# EAGLE design receiver (EAGLE 9.6.2)
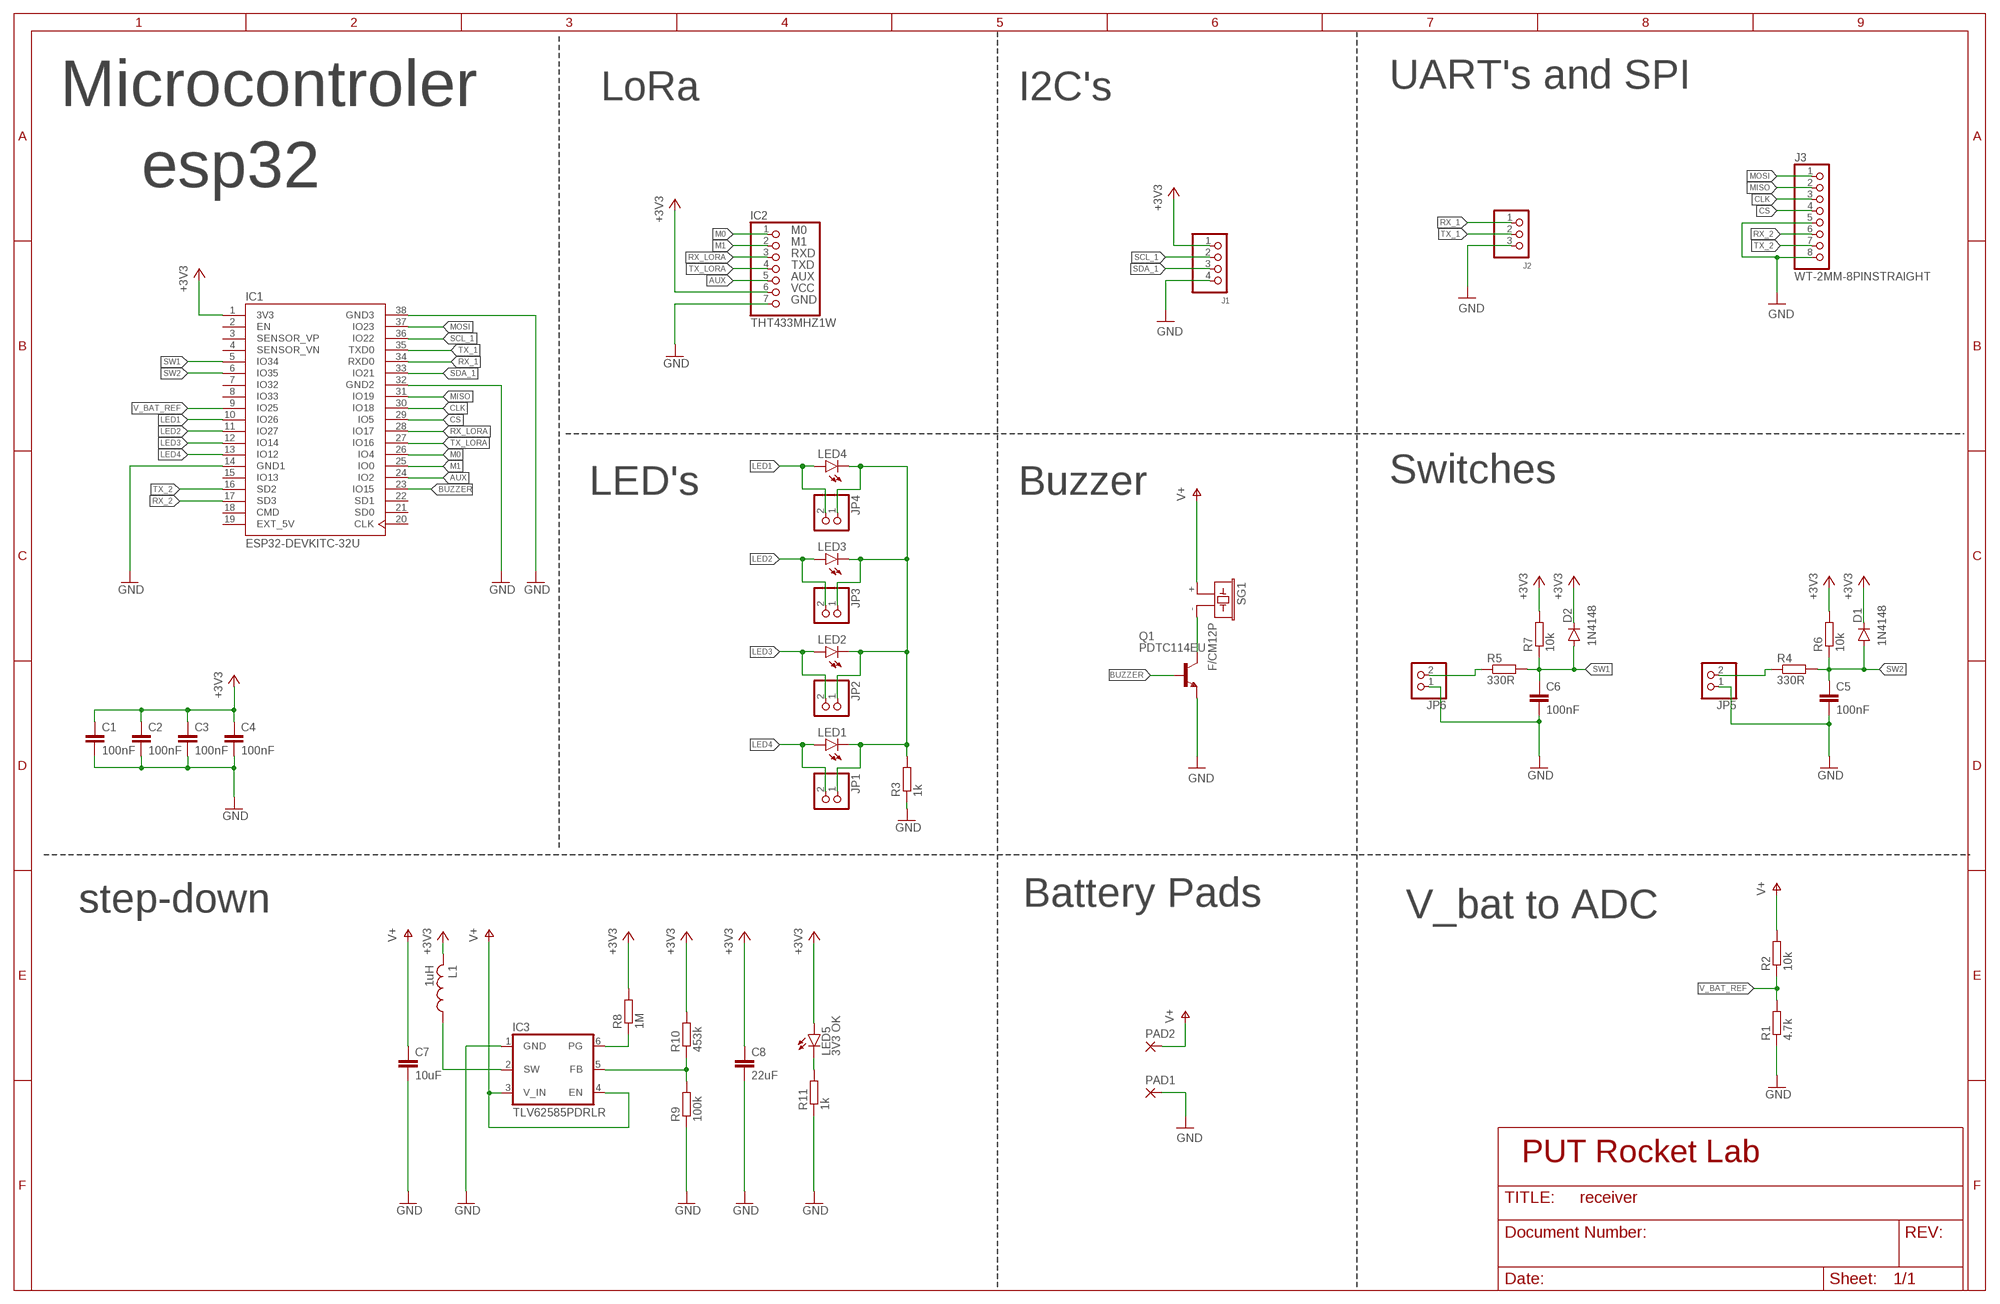
[diagram p0: schematic, sheet 1]

## Parts
C1  100nF  C-EUC0805  [C0805]
C2  100nF  C-EUC0805  [C0805]
C3  100nF  C-EUC0805  [C0805]
C4  100nF  C-EUC0805  [C0805]
C5  100nF  C-EUC0805  [C0805]
C6  100nF  C-EUC0805  [C0805]
C7  10uF  C-EUC0805  [C0805]
C8  22uF  C-EUC0805  [C0805]
D1  1N4148  DIODE-SOD80C  [SOD80C]
D2  1N4148  DIODE-SOD80C  [SOD80C]
IC1  ESP32-DEVKITC-32U  [MODULE_ESP32-DEVKITC-32U]
IC2  THT433MHZ1W  [E32M1000]
IC3  TLV62585PDRLR  [SOT563]
J1  WT-2MM-4PINSTRAIGHT  [W_TYPE_2MM_4_N]
J2  WT-2MM-3PINSTRAIGHT  [W_TYPE_2MM_3_N]
J3  WT-2MM-8PINSTRAIGHT  [W_TYPE_2MM_8_N]
JP1  PINHD-1X2  [1X02]
JP2  PINHD-1X2  [1X02]
JP3  PINHD-1X2  [1X02]
JP4  PINHD-1X2  [1X02]
JP5  PINHD-1X2  [1X02]
JP6  PINHD-1X2  [1X02]
L1  1uH  L-USL5650M  [L5650M]
LED1  LEDCHIPLED_0805  [CHIPLED_0805]
LED2  LEDCHIPLED_0805  [CHIPLED_0805]
LED3  LEDCHIPLED_0805  [CHIPLED_0805]
LED4  LEDCHIPLED_0805  [CHIPLED_0805]
LED5  3V3 OK  LEDCHIPLED_0805  [CHIPLED_0805]
PAD1  WIREPAD2,54/1,1  [2,54/1,1]
PAD2  WIREPAD2,54/1,1  [2,54/1,1]
Q1  PDTC114EU  BC846ASMD  [SOT23]
R1  4.7k  R-EU_R0805  [R0805]
R2  10k  R-EU_R0805  [R0805]
R3  1k  R-EU_R0805  [R0805]
R4  330R  R-EU_R0805  [R0805]
R5  330R  R-EU_R0805  [R0805]
R6  10k  R-EU_R0805  [R0805]
R7  10k  R-EU_R0805  [R0805]
R8  1M  R-EU_R0805  [R0805]
R9  100k  R-EU_R0805  [R0805]
R10  453k  R-EU_R0805  [R0805]
R11  1k  R-EU_R0805  [R0805]
SG1  F/CM12P  [F/CM12P]

## Nets
+3V3: C1.1 C2.1 C3.1 C4.1 C8.1 D1.C D2.C IC1.1(3V3) IC2.6(VCC) J1.1 L1.2 LED5.A R6.2 R7.2 R8.2 R10.2
AUX: IC1.24(IO2) IC2.5(AUX)
BUZZER: IC1.23(IO15) Q1.1(B)
CLK: IC1.30(IO18) J3.3
CS: IC1.29(IO5) J3.4
GND: C1.2 C2.2 C3.2 C4.2 C5.2 C6.2 C7.2 C8.2 IC1.14(GND1) IC1.32(GND2) IC1.38(GND3) IC2.7(GND) IC3.1(GND) J1.4 J2.3 J3.5 J3.8 JP5.1 JP6.1 PAD1.1(P) Q1.2(E) R1.1 R3.1 R9.1 R11.1
LED1: IC1.10(IO26) JP4.2 LED4.A
LED2: IC1.11(IO27) JP3.2 LED3.A
LED3: IC1.12(IO14) JP2.2 LED2.A
LED4: IC1.13(IO12) JP1.2 LED1.A
M0: IC1.26(IO4) IC2.1(M0)
M1: IC1.25(IO0) IC2.2(M1)
MISO: IC1.31(IO19) J3.2
MOSI: IC1.37(IO23) J3.1
N$1: JP1.1 JP2.1 JP3.1 JP4.1 LED1.C LED2.C LED3.C LED4.C R3.2
N$2: LED5.C R11.2
N$3: IC3.5(FB) R9.2 R10.1
N$4: IC3.6(PG) R8.1
N$5: IC3.2(SW) L1.1
N$6: Q1.3(C) SG1.-
N$7: JP6.2 R5.1
N$8: JP5.2 R4.1
RX_1: IC1.34(RXD0) J2.1
RX_2: IC1.17(SD3) J3.6
RX_LORA: IC1.28(IO17) IC2.3(RXD)
SCL_1: IC1.36(IO22) J1.2
SDA_1: IC1.33(IO21) J1.3
SW1: C6.1 D2.A IC1.5(IO34) R5.2 R7.1
SW2: C5.1 D1.A IC1.6(IO35) R4.2 R6.1
TX_1: IC1.35(TXD0) J2.2
TX_2: IC1.16(SD2) J3.7
TX_LORA: IC1.27(IO16) IC2.4(TXD)
V+: C7.1 IC3.3(V_IN) IC3.4(EN) PAD2.1(P) R2.2 SG1.+
V_BAT_REF: IC1.9(IO25) R1.2 R2.1
Unconnected: IC1.2(EN) IC1.3(SENSOR_VP) IC1.4(SENSOR_VN) IC1.7(IO32) IC1.8(IO33) IC1.15(IO13) IC1.18(CMD) IC1.20(CLK) IC1.21(SD0) IC1.22(SD1)

## Notes on the sheet
- LoRa | I2C's | UART's and SPI
- Microcontroler
- esp32
- LED's | Buzzer | Switches
- step-down | Battery Pads | V_bat to ADC
- PUT Rocket Lab

## Power pins joined to a net without a drawn wire
EXT_5V: IC1.19(EXT_5V)

## Library data of the parts
C1-C4 C7 C8 = PUTRocketLab_RCL:C-EU: CAPACITOR, European symbol; SPICEPREFIX: C
C5 C6 = rcl:C-EU: CAPACITOR, European symbol; SPICEPREFIX: C
D1 D2 = diode:DIODE-: DIODE
IC1 = PUTRocketLab_modules:ESP32-DEVKITC-32U: ESP32-DEVKITC Check prices <https://pricing.snapeda.com/search/part/ESP32-DEVKITC-32U/?ref=eda>; AVAILABILITY: Warning; DESCRIPTION: - Transceiver; 802.11 b/g/n (Wi-Fi, WiFi, WLAN), Bluetooth® Smart Ready 4.x Dual Mode For Use With ESP32-WROOM-32UE; MF: Espressif Systems; MP: ESP32-DEVKITC-32U; PACKAGE: None; PRICE: None; PURCHASE-URL: https://pricing.snapeda.com/search/part/ESP32-DEVKITC-32U/?ref=eda
IC2 = PUTRocketLab_modules:THT433MHZ1W
IC3 = PUTRocketLab_IC:TLV62585PDRLR
J1 = PUTRocketLab_connectors:WT-2MM-4PIN
J2 = PUTRocketLab_connectors:WT-2MM-3PIN
J3 = PUTRocketLab_connectors:WT-2MM-8PIN
JP1-JP6 = PUTRocketLab_connectors:PINHD-1X2: PIN HEADER
L1 = rcl:L-US: INDUCTOR, American symbol; SPICEPREFIX: L
LED1-LED5 = PUTRocketLab_semiconductors:LED: LED OSRAM: - CHIPLED LG R971, LG N971, LY N971, LG Q971, LY Q971, LO R971, LY R971 LH N974, LH R974 LS Q976, LO Q976, LY Q976 LO Q996 - Hyper CHIPLED LW Q18S LB Q993, LB Q99A, LB R99A - SideLED LS A670, LO A670, LY A670, LG A670, LP A670 LB A673, LV A673, LT A673, LW A673 LH A674 LY A675 LS A676, LA A676, LO A676, LY A676, LW A676 LS A679, LY A679, LG A679 - Hyper Micro SIDELED® LS Y876, LA Y876, LO Y876, LY Y876 LT Y87S - SmartLED LW L88C, LW L88S LB L89C, LB L89S, LG L890 LS L89K, LO L89K, LY L89K LS L896, LA L896, LO L896, LY L896 - TOPLED LS T670, LO T670, LY T670, LG T670, LP T670 LSG T670, LSP T670, LSY T670, LOP T670, LYG T670 LG T671, LOG T671, LSG T671 LB T673, LV T673, LT T673, LW T673 LH T674 LS T676, LA T676, LO T676, LY T676, LB T676, LH T676, LSB T676, LW T676 LB T67C, LV T67C, LT T67C, LS T67K, LO T67K, LY T67K, LW E67C LS E67B, LA E67B, LO E67B, LY E67B, LB E67C, LV E67C, LT E67C LW T67C LS T679, LY T679, LG T679 LS T770, LO T770, LY T770, LG T770, LP T770 LB T773, LV T773, LT T773, LW T773 LH T774 LS E675, LA E675, LY E675, LS T675 LS T776, LA T776, LO T776, LY T776, LB T776 LHGB T686 LT T68C, LB T68C - Hyper Mini TOPLED® LB M676 - Mini TOPLED Santana® LG M470 LS M47K, LO M47K, LY M47K Source: http://www.osram.convergy.de LUXEON: - LUMILED® LXK2-PW12-R00, LXK2-PW12-S00, LXK2-PW14-U00, LXK2-PW14-V00 LXK2-PM12-R00, LXK2-PM12-S00, LXK2-PM14-U00 LXK2-PE12-Q00, LXK2-PE12-R00, LXK2-PE12-S00, LXK2-PE14-T00, LXK2-PE14-U00 LXK2-PB12-K00, LXK2-PB12-L00, LXK2-PB12-M00, LXK2-PB14-N00, LXK2-PB14-P00, LXK2-PB14-Q00 LXK2-PR12-L00, LXK2-PR12-M00, LXK2-PR14-Q00, LXK2-PR14-R00 LXK2-PD12-Q00, LXK2-PD12-R00, LXK2-PD12-S00 LXK2-PH12-R00, LXK2-PH12-S00 LXK2-PL12-P00, LXK2-PL12-Q00, LXK2-PL12-R00 Source: www.luxeon.com KINGBRIGHT: KA-3528ASYC Source: www.kingbright.com
PAD1 PAD2 = PUTRocketLab_misc:WIREPAD: Wire PAD connect wire on PCB
Q1 = PUTRocketLab_semiconductors:BC846*: NPN Transistor
R1-R3 R8-R11 = PUTRocketLab_RCL:R-EU_: RESISTOR, European symbol; SPICEPREFIX: R
R4-R7 = rcl:R-EU_: RESISTOR, European symbol; SPICEPREFIX: R
SG1 = buzzer:F/CM12P: BUZZER Source: Buerklin; OC_FARNELL: unknown; OC_NEWARK: unknown

## Board
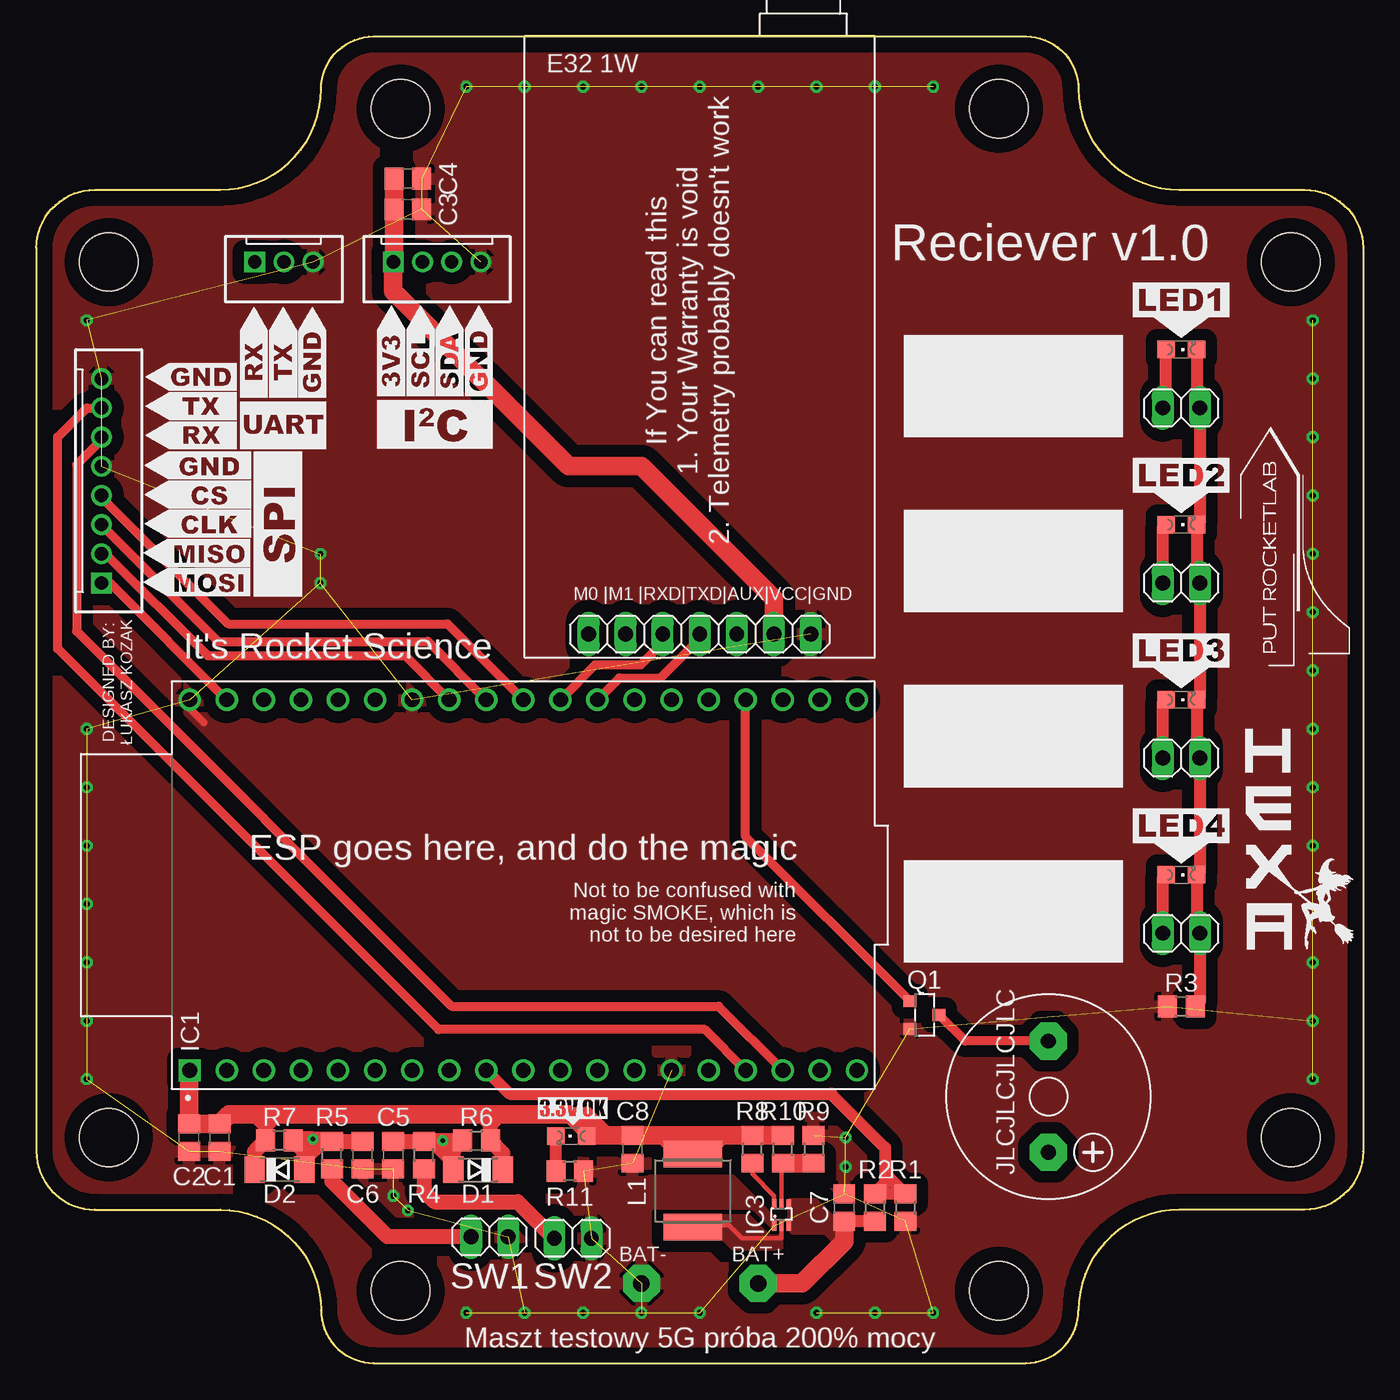
[diagram p1: board, top side]
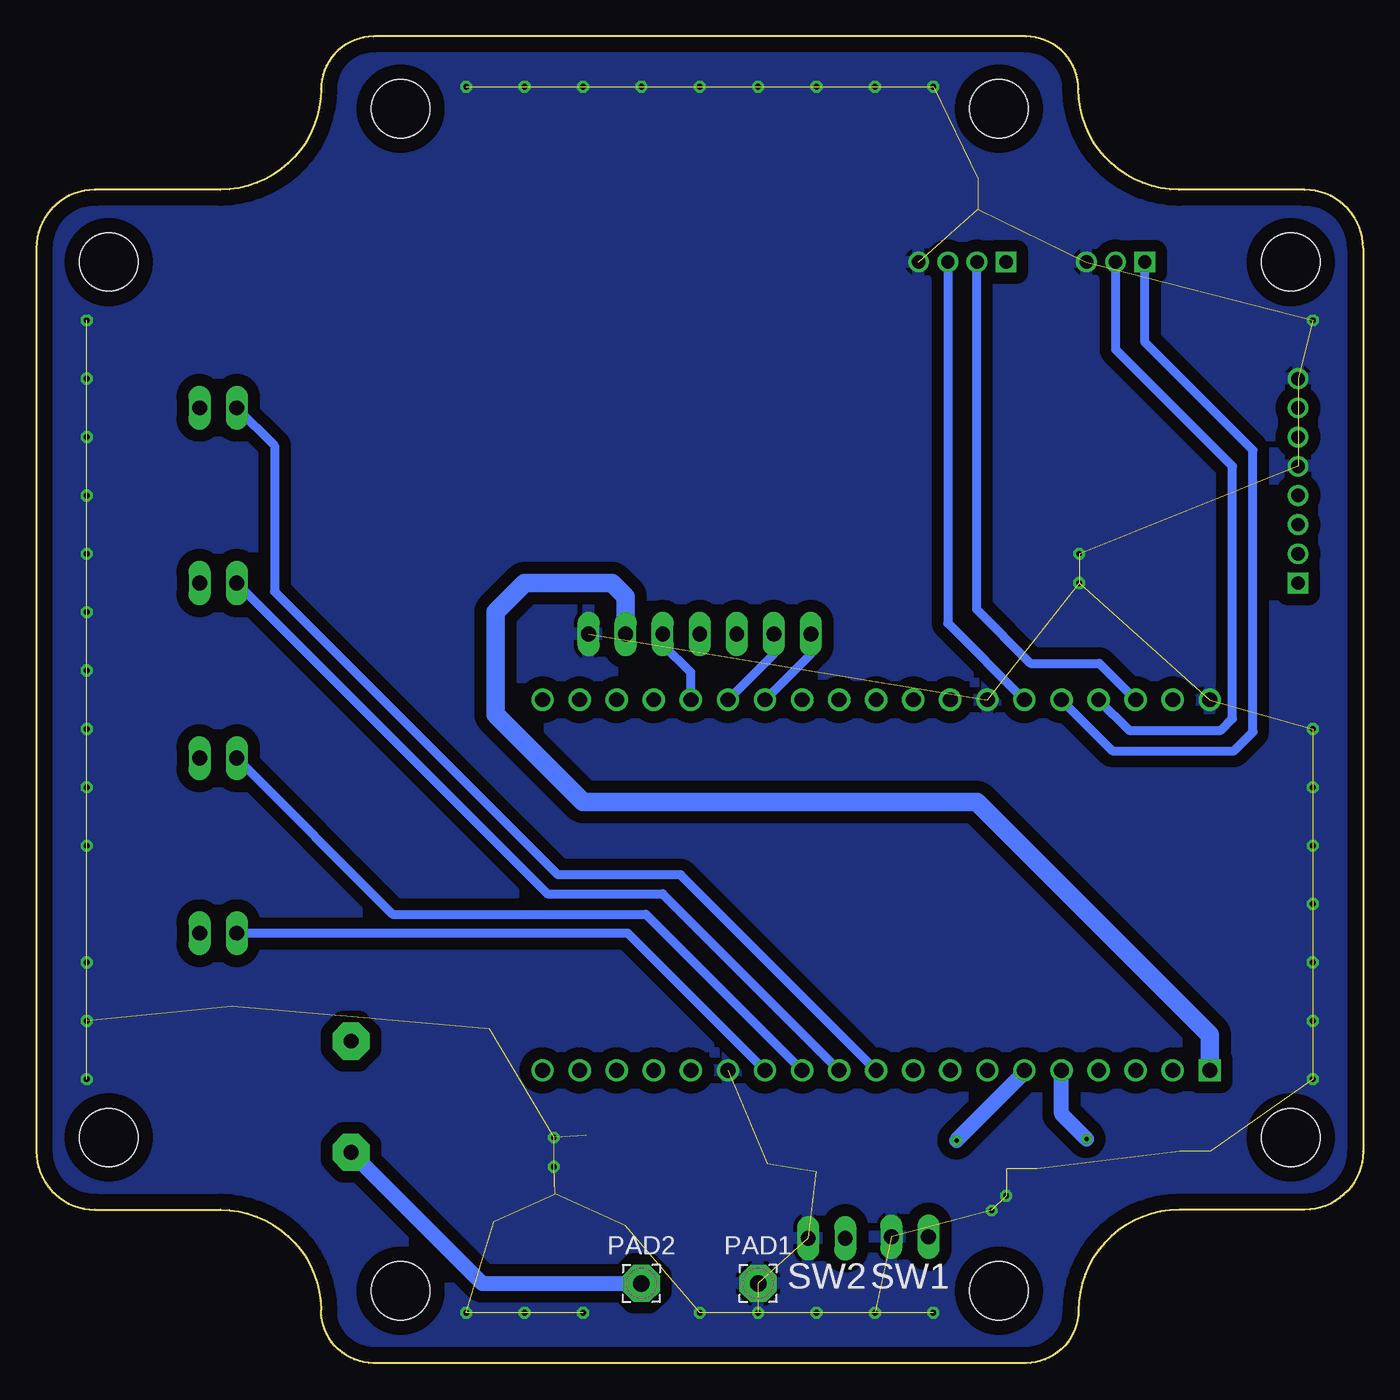
[diagram p2: board, bottom side, seen from below]

Size 90.9 x 90.9 mm. Coordinates in mm from the lower left corner, seen from the top.
Outline: 19.5,87.3 arc-90 23.1,90.9 67.8,90.9 arc-90 71.4,87.3 arc90 78.3,80.4 86.9,80.4 arc-90 90.9,76.4 90.9,14.5 arc-90 86.9,10.5 78.3,10.5 arc90 71.4,3.6 arc-90 67.8,0 23.1,0 arc-90 19.5,3.6 arc90 12.6,10.5 4,10.5 arc-90 0,14.5 0,76.4 arc-90 4,80.4 12.6,80.4 arc90 19.5,87.3
Copper layers (1*16): Top 0.035mm / dielectric 1.5mm / Bottom 0.035mm
Design rules "default *": minimum track width 6mil, minimum drill 0.3mm, track to track 10mil, track to pad 10mil, pad to pad 10mil, via to via 10mil, smd to smd 6mil, copper to edge 40mil, drill to drill 6mil, minimum pad ring 10mil, minimum via ring 8mil, stop-mask expansion 4mil, vias tented up to drill 20mil, thermal gap 10mil
Holes 4 mm at 24.95,85.95 65.95,85.95 85.95,75.45 85.95,15.45 65.95,4.95 24.95,4.95 4.95,15.45 4.95,75.45

### Footprints (pad centres in the part's own frame; a part is rotated, then mirrored left to right if it is on the bottom)
C0805 = smd 1.3 x 1.5: 1 -0.95,0; 2 0.95,0
SOD80C = smd 1.4 x 1.8: A 1.7,0; C -1.7,0
MODULE_ESP32-DEVKITC-32U = drill 1.02 square: 1 -12.7,22.85 | drill 1.02: 2 -12.7,20.31; 3 -12.7,17.77; 4 -12.7,15.23; 5 -12.7,12.69; 6 -12.7,10.15; 7 -12.7,7.61; 8 -12.7,5.07; 9 -12.7,2.53; 10 -12.7,-0.01; 11 -12.7,-2.55; 12 -12.7,-5.09; 13 -12.7,-7.63; 14 -12.7,-10.17; 15 -12.7,-12.71; 16 -12.7,-15.25; 17 -12.7,-17.79; 18 -12.7,-20.33; 19 -12.7,-22.87; 20 12.7,-22.87; 21 12.7,-20.33; 22 12.7,-17.79; 23 12.7,-15.25; 24 12.7,-12.71; 25 12.7,-10.17; 26 12.7,-7.63; 27 12.7,-5.09; 28 12.7,-2.55; 29 12.7,-0.01; 30 12.7,2.53; 31 12.7,5.07; 32 12.7,7.61; 33 12.7,10.15; 34 12.7,12.69; 35 12.7,15.23; 36 12.7,17.77; 37 12.7,20.31; 38 12.7,22.85
E32M1000 = drill 1.016 long: 1 -7.62,0; 2 -5.08,0; 3 -2.54,0; 4 0,0; 5 2.54,0; 6 5.08,0; 7 7.62,0
SOT563 = smd 0.3 x 0.67: 1 -0.5,-0.74; 2 0,-0.74; 3 0.5,-0.74; 4 0.5,0.74; 5 0,0.74; 6 -0.5,0.74
W_TYPE_2MM_4_N = drill 0.914 square: 1 -3,0 | drill 0.914: 2 -1,0; 3 1,0; 4 3,0
W_TYPE_2MM_3_N = drill 0.914 square: 1 -2,0 | drill 0.914: 2 0,0; 3 2,0
W_TYPE_2MM_8_N = drill 0.914 square: 1 -7,0 | drill 0.914: 2 -5,0; 3 -3,0; 4 -1,0; 5 1,0; 6 3,0; 7 5,0; 8 7,0
1X02 = drill 1.016 long: 1 -1.27,0; 2 1.27,0
L5650M = smd 1.8 x 4: 1 -2.5,0; 2 2.5,0
CHIPLED_0805 = smd 1.2 x 1.2: A 0,-1.05; C 0,1.05
2,54/1,1 = drill 1.118 pad 2.54 octagon: 1 0,0
SOT23 = smd 0.8 x 0.9: 1 -0.95,-1; 2 0.95,-1; 3 0,1
R0805 = smd 1.3 x 1.5: 1 -0.95,0; 2 0.95,0
F/CM12P = drill 1.016 pad 2.54 octagon: + 3.81,0; - -3.81,0

### Placement (x,y rotation side)
C1  12.55,15.45 270 top
C2  10.45,15.45 270 top
C3  25.45,79.05 0 top
C4  25.45,81.15 0 top
C5  24.45,14.25 270 top
C6  22.35,14.25 270 top
C7  55.35,10.65 90 top
C8  40.85,14.65 270 top
D1  30.25,13.25 180 top
D2  16.65,13.25 0 top
IC1  33.35,32.75 90 top
IC2  45.45,49.95 0 top
IC3  51.05,10.15 0 top
J1  27.45,75.45 0 top
J2  16.95,75.45 0 top
J3  4.45,60.45 90 top
JP1  78.45,29.45 180 top
JP2  78.45,41.45 180 top
JP3  78.45,53.45 180 top
JP4  78.45,65.45 180 top
JP5  36.75,8.55 180 top
JP6  31.05,8.65 180 top
L1  44.97,11.82 90 top
LED1  78.45,33.45 270 top
LED2  78.45,45.45 270 top
LED3  78.45,57.45 270 top
LED4  78.45,69.45 270 top
LED5  36.65,15.55 90 top
PAD1  41.45,5.45 270 bottom
PAD2  49.45,5.45 270 bottom
Q1  60.85,23.85 270 top
R1  59.55,10.65 90 top
R2  57.45,10.65 270 top
R3  78.45,24.45 0 top
R4  26.55,14.25 90 top
R5  20.25,14.25 90 top
R6  30.15,15.25 0 top
R7  16.65,15.25 180 top
R8  49.05,14.65 90 top
R9  53.25,14.65 270 top
R10  51.15,14.65 90 top
R11  36.55,13.15 180 top
SG1  69.35,18.25 270 top

### Tracks (layer width: path | path; a pad name or v marks a point on that pad's centre or on a via)
+3V3
  Top 0.508: 42.45,15.6 43.73,14.32 L1.2 46.17,14.32 47.45,15.6
  Top 1.016: LED5.A 37.7,15.8 36.45,17.05 37.7,17.05 39.15,15.6 | D2.C 14.95,14.5 R7.2 15.7,16.3 | 15.7,16.3 16.45,17.05 | 15.7,16.3 14.95,17.05 | D1.C 31.95,14.4 R6.2 31.1,16.4 | 31.1,16.4 30.45,17.05 | 31.1,16.4 31.75,17.05
  Top 1.27: IC2.6 50.53,52.37 41.45,61.45 36.45,61.45 24.45,73.45 J1.1 24.5,75.5 C3.1 C4.1 | R10.2 R8.2 47.45,15.6 46.25,15.6 | 46.25,15.6 L1.2 | 46.25,15.6 42.45,15.6 C8.1 39.15,15.6 37.75,15.6 LED5.A 37.9,15.55 | IC1.1 10.45,20 C2.1 C1.1 13.2,17.05 14.95,17.05 16.45,17.05 30.45,17.05 31.75,17.05 36.45,17.05
  Bottom 1.27: IC1.1 10.5,22.5 26.45,38.45 53.45,38.45 59.45,44.45 59.45,51.45 57.45,53.45 51.45,53.45 50.53,52.53 IC2.6
AUX
  Bottom 0.61: IC1.24 46.06,47.32 47.99,49.25 IC2.5
BUZZER
  Top 0.61: Q1.1 48.6,36.05 IC1.23
CLK
  Top 0.61: J3.3 12.45,49.45 26.82,49.45 IC1.30
CS
  Top 0.61: J3.4 4.45,59.35 13.15,50.65 28.16,50.65 IC1.29
GND  (via drill 0.4)  (68 unrouted)
  Top 0.508: 11.45,43.9 10.5,44.85 IC1.38
  other vias: 55.45,15.45 55.45,13.45 29.45,3.45 33.45,3.45 37.45,3.45 41.45,3.45 45.45,3.45 53.45,3.45 57.45,3.45 61.45,3.45 87.45,19.45 87.45,23.45 87.45,27.45 87.45,43.45 87.45,35.45 87.45,39.45 87.45,47.45 87.45,51.45 87.45,55.45 87.45,59.45 87.45,63.45 87.45,67.45 87.45,71.45 61.45,87.45 57.45,87.45 53.45,87.45 49.45,87.45 45.45,87.45 41.45,87.45 37.45,87.45 33.45,87.45 29.45,87.45 3.45,71.45 3.45,19.45 3.45,23.45 3.45,27.45 3.45,31.45 3.45,35.45 3.45,39.45 3.45,43.45 19.45,55.45 19.45,53.45 24.45,11.45 25.45,10.45
  pour Top (isolate 0.813, rank 3): -22.55,42.45 -22.55,66.45 14.45,103.45 15.45,104.45 88.45,104.45 109.45,83.45 109.45,52.45 109.45,-3.55 105.45,-7.55 93.45,-19.55 49.45,-19.55 11.45,-19.55 -8.55,0.45 -22.55,14.45
  pour Bottom (isolate 0.813, rank 3): -31.55,68.45 12.45,112.45 48.45,112.45 93.45,112.45 112.45,93.45 121.45,84.45 121.45,29.45 121.45,-16.55 115.45,-22.55 106.45,-31.55 18.45,-31.55 1.45,-31.55 -25.55,-4.55 -31.55,1.45
  pour Top (rank 3, no thermals): 50.65,9.15 50.65,9.95 47.75,12.85 41.95,12.85 41.95,10.55 48.95,10.55 50.35,9.15
LED1
  Top 0.813: JP4.2 77.4,65.45 LED4.A
  Bottom 0.61: IC1.10 46.76,33.45 55.15,33.45 74.58,52.88 74.58,62.85 JP4.2
LED2
  Top 0.813: JP3.2 77.18,57.23 LED3.A
  Bottom 0.61: IC1.11 48,32.15 55.88,32.15 JP3.2
LED3
  Top 0.813: JP2.2 77.18,45.23 LED2.A
  Bottom 0.61: IC1.12 49.14,30.75 66.48,30.75 JP2.2
LED4
  Top 0.813: JP1.2 77.18,33.23 LED1.A
  Bottom 0.61: IC1.13 50.38,29.45 JP1.2
M0
  Bottom 0.61: IC1.26 37.83,48.6 IC2.1
M1
  Bottom 0.61: IC1.25 40.37,48.6 IC2.2
MISO
  Top 0.61: IC1.31 25.28,48.45 11.75,48.45 4.75,55.45 J3.2
MOSI
  Top 0.61: IC1.37 5.04,53.45 J3.1
N$1
  Top 0.813: LED4.C 79.5,65.67 JP4.1 79.72,57.67 LED3.C 79.5,53.67 JP3.1 79.72,45.67 LED2.C 79.5,41.67 JP2.1 79.72,33.67 LED1.C 79.5,29.67 JP1.1 79.72,24.77 R3.2
N$2
  Top 0.813: R11.2 LED5.C
N$3
  Top 0.305: R10.1 51.05,13.6 IC3.5
  Top 1.27: R9.2 R10.1
N$4
  Top 0.305: IC3.6 50.55,11.45 49.05,12.95 R8.1
N$5
  Top 0.305: IC3.2 51.05,8.55 48.35,8.55 47.45,9.45 45.1,9.45 L1.1
  pour Top (no thermals): 50.95,9.35 50.95,9.05 50.75,8.85 50.15,8.85 48.85,10.15 46.55,10.15 46.55,8.85 47.65,7.75 51.05,7.75 51.15,7.85 51.15,9.35
N$6
  Top 0.61: SG1.- 63.64,22.06 Q1.3
N$7
  Top 1.016: JP6.2 24.05,8.65 20.25,12.45 R5.1
N$8
  Top 1.016: R4.1 26.55,11.75 27.25,11.05 32.98,11.05 JP5.2
RX_1
  Bottom 0.61: IC1.34 17.16,41.95 8.85,41.95 7.55,43.25 7.55,62.55 14.95,69.95 J2.1
RX_2
  Top 0.61: J3.6 4.45,63.25 2.75,61.55 2.75,50.15 28.45,24.45 46.74,24.45 IC1.17
RX_LORA
  Top 0.61: IC1.28 38.3,47.85 41.41,47.85 42.91,49.35 IC2.3
SCL_1
  Bottom 0.61: J1.2 26.48,75.42 26.48,51.65 22.78,47.95 18.08,47.95 IC1.36
SDA_1
  Bottom 0.61: J1.3 28.45,50.7 IC1.33
SW1  (via drill 0.3)
  Top 1.016: R5.2 20.1,15.35 v18.95,15.35 17.7,15.35 R7.1 18.35,14.5 18.35,13.95 | R5.2 C6.1 | D2.A 18.35,13.95 | R5.2 19.6,15.2 18.35,13.95
  Bottom 1.016: v18.95,15.35 20.66,17.06 IC1.5
SW2  (via drill 0.3)
  Top 1.016: C5.1 R4.2 26.6,15.25 27.15,15.25 | 27.15,15.25 28.55,13.85 D1.A 28.55,14.6 R6.1 v27.85,15.25 27.15,15.25
  Bottom 1.016: v27.85,15.25 23.2,19.9 IC1.6
TX_1
  Bottom 0.61: IC1.35 16.02,43.35 9.75,43.35 8.95,44.15 8.95,61.45 16.95,69.45 J2.2
TX_2
  Top 0.61: IC1.16 45.8,22.85 27.55,22.85 1.45,48.95 1.45,63.45 3.45,65.45 J3.7
TX_LORA
  Top 0.61: IC1.27 39.94,46.95 42.75,46.95 45.45,49.65 IC2.4
V+
  Top 0.813: R2.2 C7.1
  Top 1.27: C7.1 55.35,8.35 52.45,5.45 PAD2.1
  Bottom 1.016: SG1.+ 60.36,5.45 PAD2.1
  pour Top (rank 2, no thermals): 51.45,11.25 51.45,9.15 51.75,8.85 53.95,8.85 54.85,7.95 54.85,9.85 53.45,11.25
V_BAT_REF
  Top 0.813: IC1.9 32.42,18.45 54.45,18.45 58.15,14.75 58.15,12.6 | 58.15,12.6 58.15,12.3 R2.1 R1.2 58.55,12.6 58.15,12.6

### Text on the board
tNames: Reciever v1.0 | If You can read this / 1. Your Warranty is void / 2. Telemetry probably doesn't work | It's Rocket Science | DESIGNED BY: / ŁUKASZ KOZAK | ESP goes here, and do the magic | Not to be confused with / magic SMOKE, which is / not to be desired here | JLCJLCJLCJLC | BAT- | BAT+ | SW1 | SW2 | Maszt testowy 5G próba 200% mocy
bNames: SW1 | SW2